# EAGLE design Macro Keyboard 32u4 Row Column MiniMacro v1.0 (EAGLE 9.6.2)
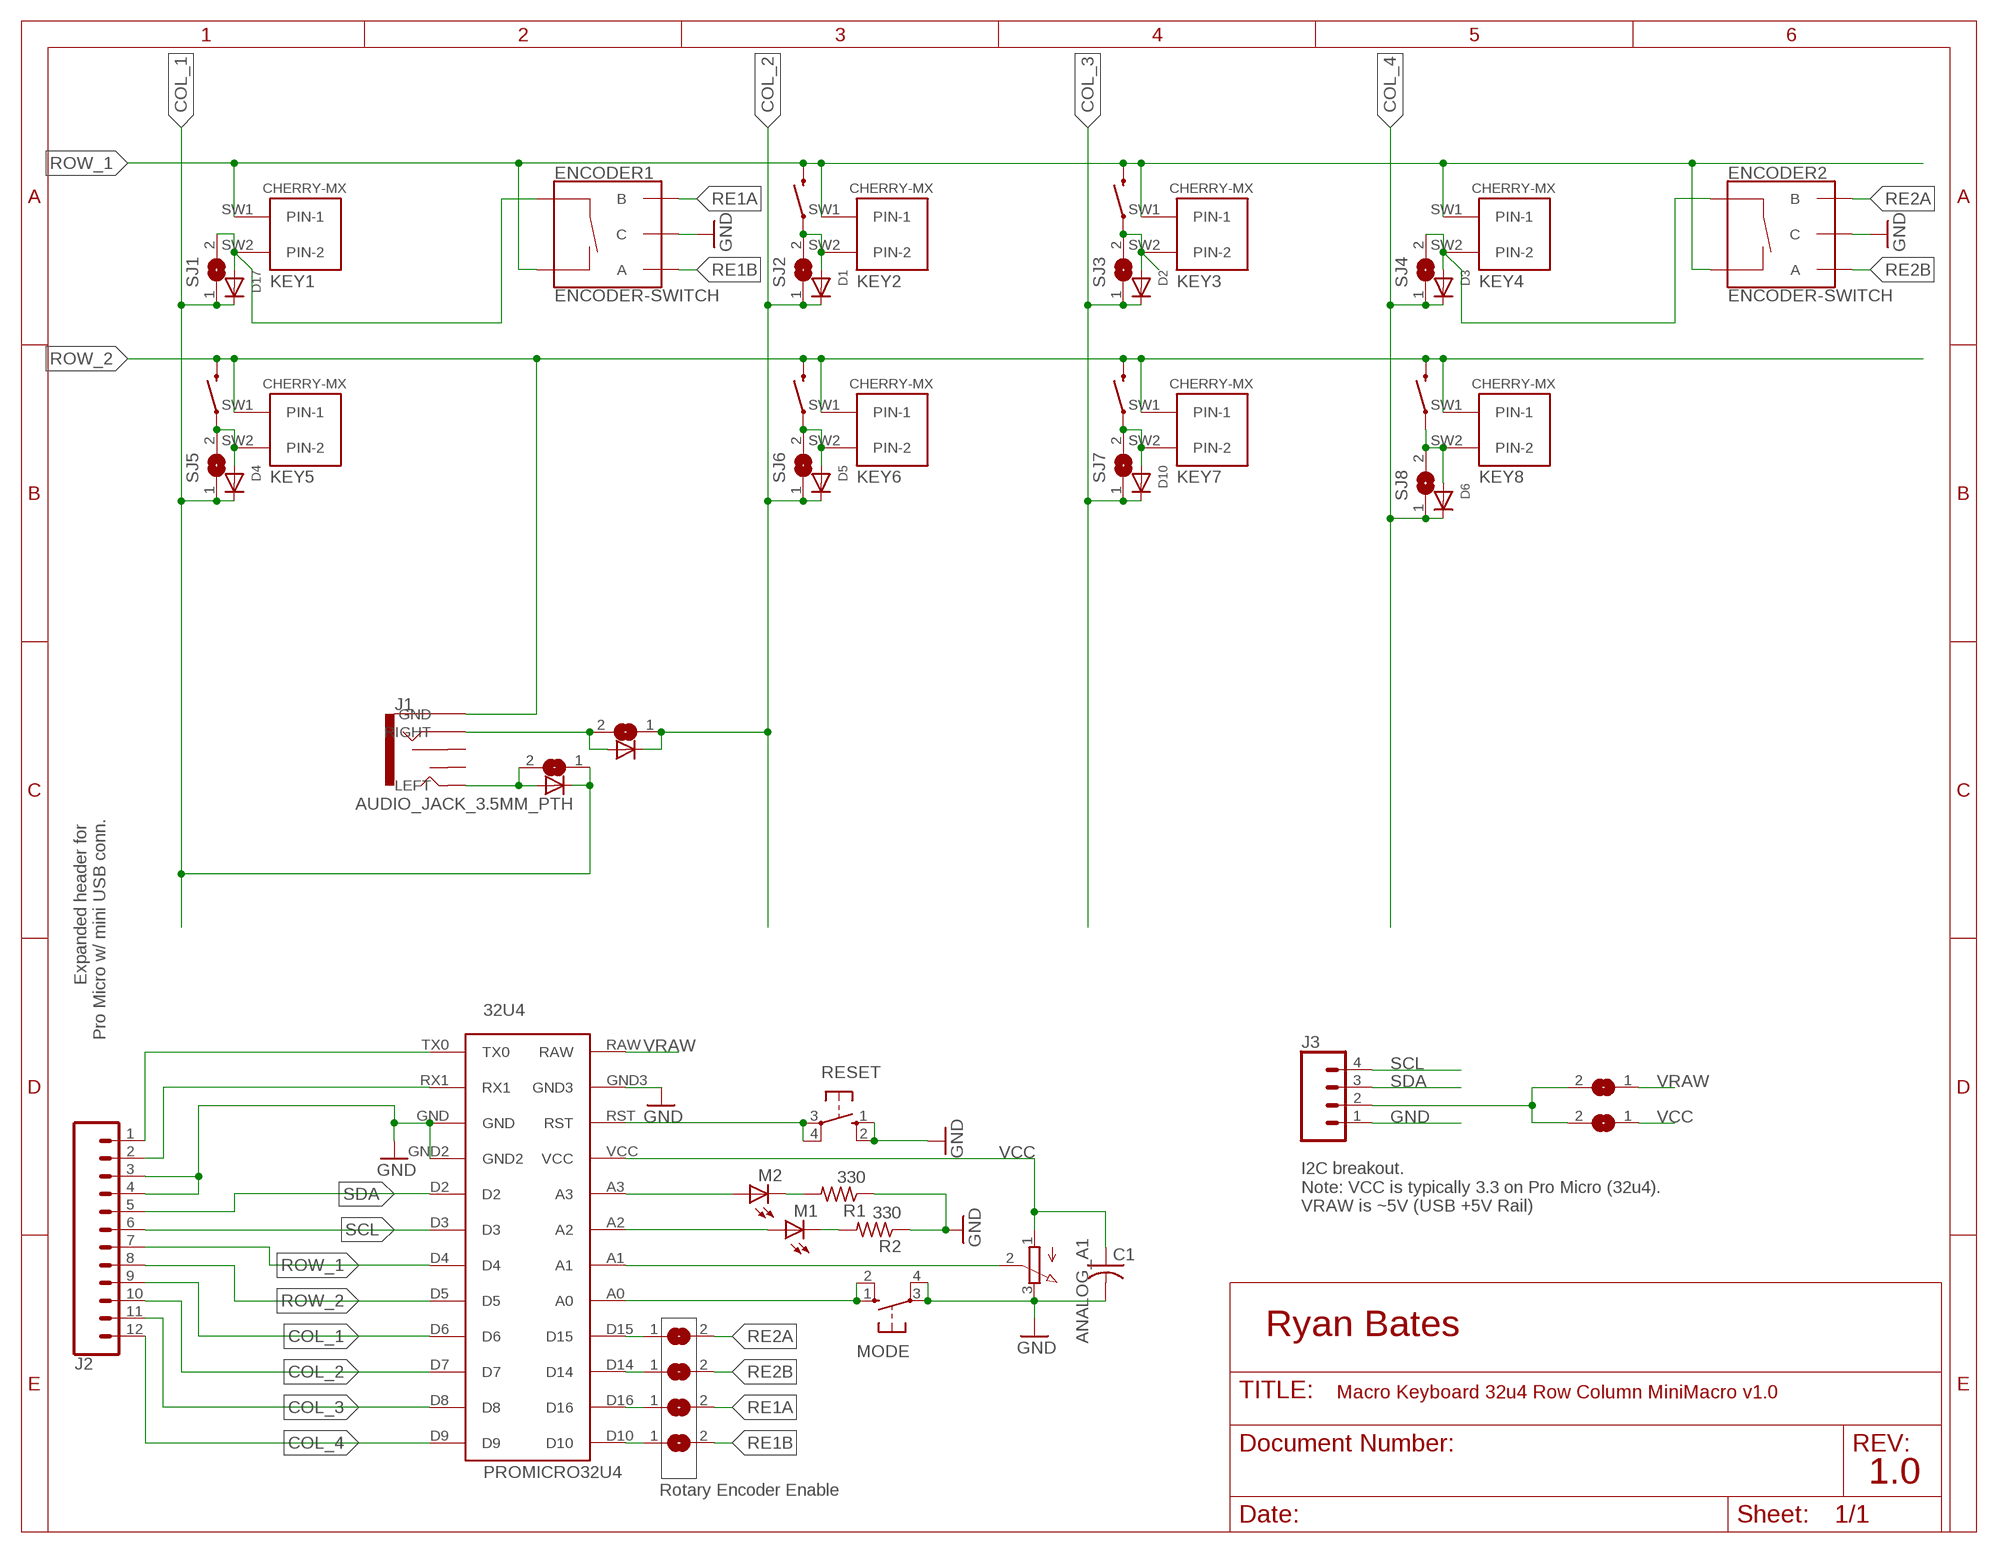
[diagram p0: schematic, sheet 1]

## Parts
32U4  PROMICRO32U4  [PROMICRO32U4]
ANALOG_A1  3RP/1610N  [3RP/1610N]
C1  C-USC1206  [C1206]
D1  DIODESOD-123  [SOD-123]
D2  DIODESOD-123  [SOD-123]
D3  DIODESOD-123  [SOD-123]
D4  DIODESOD-123  [SOD-123]
D5  DIODESOD-123  [SOD-123]
D6  DIODESOD-123  [SOD-123]
D10  DIODESOD-123  [SOD-123]
D15  DIODESOD-123  [SOD-123]
D16  DIODESOD-123  [SOD-123]
D17  DIODESOD-123  [SOD-123]
ENCODER1  ENCODER-SWITCH  [ROTARY_ENC_PLAIN]
ENCODER2  ENCODER-SWITCH  [ROTARY_ENC_PLAIN]
J1  AUDIO_JACK_3.5MM_PTH  [AUDIO-JACK]
J2  CONN_12NO_SILK  [1X12_NO_SILK]
J3  CONN_041X04_NO_SILK  [1X04_NO_SILK]
KEY1  CHERRY-MX  [CHERRY-MX]
KEY2  CHERRY-MX  [CHERRY-MX]
KEY3  CHERRY-MX  [CHERRY-MX]
KEY4  CHERRY-MX  [CHERRY-MX]
KEY5  CHERRY-MX  [CHERRY-MX]
KEY6  CHERRY-MX  [CHERRY-MX]
KEY7  CHERRY-MX  [CHERRY-MX]
KEY8  CHERRY-MX  [CHERRY-MX]
M1  LEDCHIPLED_1206  [CHIPLED_1206]
M2  LEDCHIPLED_1206  [CHIPLED_1206]
MODE  10-XX  [B3F-10XX]
R1  330  R-US_R1206  [R1206]
R2  330  R-US_R1206  [R1206]
RESET  10-XX  [B3F-10XX]
S1  MOMENTARY-SWITCH-SPST-PTH-12MM  [TACTILE_SWITCH_PTH_12MM]
S2  MOMENTARY-SWITCH-SPST-PTH-12MM  [TACTILE_SWITCH_PTH_12MM]
S3  MOMENTARY-SWITCH-SPST-PTH-12MM  [TACTILE_SWITCH_PTH_12MM]
S4  MOMENTARY-SWITCH-SPST-PTH-12MM  [TACTILE_SWITCH_PTH_12MM]
S9  MOMENTARY-SWITCH-SPST-PTH-12MM  [TACTILE_SWITCH_PTH_12MM]
S10  MOMENTARY-SWITCH-SPST-PTH-12MM  [TACTILE_SWITCH_PTH_12MM]
SJ1  SJ  [SJ]
SJ2  SJ  [SJ]
SJ3  SJ  [SJ]
SJ4  SJ  [SJ]
SJ5  SJ  [SJ]
SJ6  SJ  [SJ]
SJ7  SJ  [SJ]
SJ8  SJ  [SJ]
SJ9  SJ  [SJ]
SJ10  SJ  [SJ]
SJ16  SJ  [SJ]
SJ17  SJ  [SJ]
SJ18  SJ  [SJ]
SJ19  SJ  [SJ]
SJ20  SJ  [SJ]
SJ21  SJ  [SJ]

## Nets
COL_1: 32U4.D6 D4.C D15.C D17.C J2.9 SJ1.1 SJ5.1 SJ16.1
COL_2: 32U4.D7 D1.C D5.C D16.C J2.10 SJ2.1 SJ6.1 SJ17.1
COL_3: 32U4.D8 D2.C D10.C J2.11 SJ3.1 SJ7.1
COL_4: 32U4.D9 D3.C D6.C J2.12 SJ4.1 SJ8.1
GND: 32U4.GND 32U4.GND2 32U4.GND3 ANALOG_A1.3(E) C1.2 ENCODER1.C ENCODER2.C J2.3 J2.4 J3.1 MODE.3(P) MODE.4(P1) R1.1 R2.1 RESET.1(S) RESET.2(S1)
N$1: 32U4.RX1 J2.2
N$2: D1.A KEY2.SW2(PIN-2) S4.1 SJ2.2
N$3: D4.A KEY5.SW2(PIN-2) S9.1 SJ5.2
N$4: D5.A KEY6.SW2(PIN-2) S10.1 SJ6.2
N$5: J3.2 SJ9.2 SJ10.2
N$7: D3.A ENCODER2.SW+ KEY4.SW2(PIN-2) SJ4.2
N$8: D2.A KEY3.SW2(PIN-2) S3.1 SJ3.2
N$9: D16.A J1.RIGHT SJ17.2
N$10: 32U4.RST RESET.3(P) RESET.4(P1)
N$11: 32U4.TX0 J2.1
N$12: 32U4.A0 MODE.1(S) MODE.2(S1)
N$13: 32U4.A3 M2.A
N$14: M2.C R1.2
N$15: D10.A KEY7.SW2(PIN-2) S1.1 SJ7.2
N$19: D6.A KEY8.SW2(PIN-2) S2.1 SJ8.2
N$20: D17.A ENCODER1.SW+ KEY1.SW2(PIN-2) SJ1.2
N$21: M1.C R2.2
N$22: 32U4.A2 M1.A
N$25: 32U4.A1 ANALOG_A1.2(S)
N$35: 32U4.D15 SJ18.1
N$36: 32U4.D14 SJ19.1
N$37: 32U4.D16 SJ20.1
N$38: 32U4.D10 SJ21.1
N$41: D15.A J1.LEFT SJ16.2
RE1A: ENCODER1.B SJ20.2
RE1B: ENCODER1.A SJ21.2
RE2A: ENCODER2.B SJ18.2
RE2B: ENCODER2.A SJ19.2
ROW_1: 32U4.D4 ENCODER1.SW- ENCODER2.SW- J2.7 KEY1.SW1(PIN-1) KEY2.SW1(PIN-1) KEY3.SW1(PIN-1) KEY4.SW1(PIN-1) S3.3 S4.3
ROW_2: 32U4.D5 J1.GND J2.8 KEY5.SW1(PIN-1) KEY6.SW1(PIN-1) KEY7.SW1(PIN-1) KEY8.SW1(PIN-1) S1.3 S2.3 S9.3 S10.3
SCL: 32U4.D3 J2.6 J3.4
SDA: 32U4.D2 J2.5 J3.3
VCC: 32U4.VCC ANALOG_A1.1(A) C1.1 SJ10.1
VRAW: 32U4.RAW SJ9.1
Unconnected: J1.RSH J1.TSH

## Notes on the sheet
- Expanded header for 
  Pro Micro w/ mini USB conn.
- I2C breakout. 
  Note: VCC is typically 3.3 on Pro Micro (32u4).
  VRAW is ~5V (USB +5V Rail)
- Ryan Bates
- 1.0
- Rotary Encoder Enable

## Library data of the parts
32U4 = Pro-micro32u4:PROMICRO32U4
ANALOG_A1 = pot:3RP/1610N: 16mm Potentiometer one level Source: http://www.alphapotentiometers.net/html/16mm_pot_2.html
C1 = adafruit:C-US: CAPACITOR, American symbol
D1-D6 D10 D15-D17 = adafruit:DIODE: Diode SMADIODE - SMA Surface Mount Package 20V 1A Schottky Diode Digikey: 641-1014-6-ND DO-1N4148 - Through Hole Small Current Diode SOD-123 20V 1 A (.5mV Vf) Schottky Diode - Digikey: MBRX120TPMSCT-ND SOD-323 10V 570mA (.38mV Vf, 3ns) Schottky Diode - Digikey: ZLLS410CT-ND SOD-523 30V 30mA Schottky Diode (RB751S-40TE61) - Digikey: RB751S-40TE61CT-ND SOT23-R/W - SOT23 Package (R = Solder Paste/Reflow Ovens, W = Hand-Soldering) BAT54Film 40V 300mA - Digikey: 497-7162-1-ND
ENCODER1 ENCODER2 = SparkFun-Switches:ENCODER-SWITCH: Rotary Encoder w/ Select Switch Encoders rotate similarly to potentiometers, but they’re different from potentiometers in that an encoder has full rotation without limits. They output gray code so that you can tell how much and in which direction the encoder has been turned. This encoder includes a push-down select switch built into the shaft. SparkFun Products Rotary Encoder <https://www.sparkfun.com/products/9117> (COM-09117); SF_SKU: COM-09117
J1 = SparkFun-Connectors:AUDIO_JACK_3.5MM: Audio Jack 3.5mm variants of PTH and SMT stereo audio jack with bypass switches. SparkFun Products: SparkFun SparkPunk Sound Kit <[https://www.sparkfun.com/products/11177]> - PTH MP3 Trigger <https://www.sparkfun.com/products/13720> -3.5mm SMD SparkFun PicoBoard <https://www.sparkfun.com/products/11888>- 2.5mm SMD; PROD_ID: CONN-08774; SF_ID: PRT-08032
J2 = SparkFun-Connectors:CONN_12: Multi connection point. Often used as Generic Header-pin footprint for 0.1 inch spaced/style header connections On any of the 0.1 inch spaced packages, you can populate with these: Break Away Headers - Straight <https://www.sparkfun.com/products/116> (PRT-00116) Break Away Male Headers - Right Angle <https://www.sparkfun.com/products/553> (PRT-00553) Female Headers <https://www.sparkfun.com/products/115> (PRT-00115) Break Away Headers - Machine Pin <https://www.sparkfun.com/products/117> (PRT-00117) Break Away Female Headers - Swiss Machine Pin <https://www.sparkfun.com/products/743> (PRT-00743) For SCREWTERMINALS and SPRING TERMINALS visit here: Screw Terimnals on SparkFun.com <https://www.sparkfun.com/search/results?term=Screw+Terminals> (5mm/3.5mm/2.54mm spacing) This device is also useful as a general connection point to wire up your design to another part of your project. Our various solder wires solder well into these plated through hole pads. Hook-Up Wire - Assortment (Stranded, 22 AWG) <https://www.sparkfun.com/products/11375> (PRT-11375) Hook-Up Wire - Assortment (Solid Core, 22 AWG) <https://www.sparkfun.com/products/11367> (PRT-11367) View the entire wire category on our website here <https://www.sparkfun.com/categories/141> Special notes: Molex polarized connector foot print use with SKU : PRT-08231 with associated crimp pins and housings. 1MM SMD Version SKU: PRT-10208 NOTES ON THE VARIANTS LOCK and LOCK_LONGPADS... This footprint was designed to help hold the alignment of a through-hole component (i.e. 6-pin header) while soldering it into place. You may notice that each hole has been shifted either up or down by 0.005 of an inch from it's more standard position (which is a perfectly straight line). This slight alteration caused the pins (the squares in the middle) to touch the edges of the holes. Because they are alternating, it causes a "brace" to hold the component in place. 0.005 has proven to be the perfect amount of "off-center" position when using our standard breakaway headers. Although looks a little odd when you look at the bare footprint, once you have a header in there, the alteration is very hard to notice. Also,if you push a header all the way into place, it is covered up entirely on the bottom side.
J3 = SparkFun-Connectors:CONN_04: Multi connection point. Often used as Generic Header-pin footprint for 0.1 inch spaced/style header connections On any of the 0.1 inch spaced packages, you can populate with these: Break Away Headers - Straight <https://www.sparkfun.com/products/116> (PRT-00116) Break Away Male Headers - Right Angle <https://www.sparkfun.com/products/553> (PRT-00553) Female Headers <https://www.sparkfun.com/products/115> (PRT-00115) Break Away Headers - Machine Pin <https://www.sparkfun.com/products/117> (PRT-00117) Break Away Female Headers - Swiss Machine Pin <https://www.sparkfun.com/products/743> (PRT-00743) For SCREWTERMINALS and SPRING TERMINALS visit here: Screw Terimnals on SparkFun.com <https://www.sparkfun.com/search/results?term=Screw+Terminals> (5mm/3.5mm/2.54mm spacing) This device is also useful as a general connection point to wire up your design to another part of your project. Our various solder wires solder well into these plated through hole pads. Hook-Up Wire - Assortment (Stranded, 22 AWG) <https://www.sparkfun.com/products/11375> (PRT-11375) Hook-Up Wire - Assortment (Solid Core, 22 AWG) <https://www.sparkfun.com/products/11367> (PRT-11367) View the entire wire category on our website here <https://www.sparkfun.com/categories/141> Special notes: Molex polarized connector foot print use with SKU : PRT-08231 with associated crimp pins and housings. 1MM SMD Version SKU: PRT-10208; PROD_ID: CONN-09696
KEY1-KEY8 = cherrymx:CHERRY-MX: Cherry MX series keyswitch
M1 M2 = adafruit:LED: LED OSRAM: - CHIPLED LG R971, LG N971, LY N971, LG Q971, LY Q971, LO R971, LY R971 LH N974, LH R974 LS Q976, LO Q976, LY Q976 LO Q996 - Hyper CHIPLED LW Q18S LB Q993, LB Q99A, LB R99A - SideLED LS A670, LO A670, LY A670, LG A670, LP A670 LB A673, LV A673, LT A673, LW A673 LH A674 LY A675 LS A676, LA A676, LO A676, LY A676, LW A676 LS A679, LY A679, LG A679 - Hyper Micro SIDELED® LS Y876, LA Y876, LO Y876, LY Y876 LT Y87S - SmartLED LW L88C, LW L88S LB L89C, LB L89S, LG L890 LS L89K, LO L89K, LY L89K LS L896, LA L896, LO L896, LY L896 - TOPLED LS T670, LO T670, LY T670, LG T670, LP T670 LSG T670, LSP T670, LSY T670, LOP T670, LYG T670 LG T671, LOG T671, LSG T671 LB T673, LV T673, LT T673, LW T673 LH T674 LS T676, LA T676, LO T676, LY T676, LB T676, LH T676, LSB T676, LW T676 LB T67C, LV T67C, LT T67C, LS T67K, LO T67K, LY T67K, LW E67C LS E67B, LA E67B, LO E67B, LY E67B, LB E67C, LV E67C, LT E67C LW T67C LS T679, LY T679, LG T679 LS T770, LO T770, LY T770, LG T770, LP T770 LB T773, LV T773, LT T773, LW T773 LH T774 LS E675, LA E675, LY E675, LS T675 LS T776, LA T776, LO T776, LY T776, LB T776 LHGB T686 LT T68C, LB T68C - Hyper Mini TOPLED® LB M676 - Mini TOPLED Santana® LG M470 LS M47K, LO M47K, LY M47K Source: http://www.osram.convergy.de/
MODE RESET = switch-omron:10-XX: OMRON SWITCH; MPN: B3F-1000; OC_FARNELL: 176432; OC_NEWARK: 36M3542
R1 R2 = adafruit:R-US_: RESISTOR, American symbol
S1-S4 S9 S10 = SparkFun-Switches:MOMENTARY-SWITCH-SPST: Momentary Switch (Pushbutton) - SPST Normally-open (NO) SPST momentary switches (buttons, pushbuttons). Variants PTH-12MM - 12mm square, through-hole Momentary Pushbutton Switch - 12mm Square <https://www.sparkfun.com/products/9190> (COM-09190) PTH-6.0MM, PTH-6.0MM-KIT - 6.0mm square, through-hole Mini Pushbutton Switch <https://www.sparkfun.com/products/97> (COM-00097) KIT package intended for soldering kit's - only one side of pads' copper is exposed. PTH-RIGHT-ANGLE-KIT - Right-angle, through-hole Right Angle Tactile Button <https://www.sparkfun.com/products/10791> - Used on SparkFun BigTime Watch Kit <https://www.sparkfun.com/products/11734> SMD-12MM - 12mm square, surface-mount Tactile Button - SMD (12mm) <https://www.sparkfun.com/products/12993> (COM-12993) Used on SparkFun PicoBoard <https://www.sparkfun.com/products/11888> SMD-4.5MM - 4.5mm Square Trackball Switch Used on SparkFun Blackberry Trackballer Breakout <https://www.sparkfun.com/products/13169> SMD-4.6MMX2.8MM - 4.60mm x 2.80mm, surface mount Used on SparkFun SAMD21 Mini Breakout <https://www.sparkfun.com/products/13664> SMD-5.2MM, SMD-5.2-REDUNDANT - 5.2mm square, surface-mount Mini Pushbutton Switch - SMD <https://www.sparkfun.com/products/8720> (COM-08720) Used on Arduino Pro Mini <https://www.sparkfun.com/products/11114> REDUNDANT package connects both switch circuits together SMD-6.0X3.5MM - 6.0 x 3.5mm, surface mount Momentary Reset Switch SMD <https://www.sparkfun.com/products/8229> (COM-08229) SMD-6.2MM-TALL - 6.2mm square, surface mount Tactile Button - SMD (6mm) <https://www.sparkfun.com/products/12992> Used on SparkFun Digital Sandbox <https://www.sparkfun.com/products/12651> SMD-RIGHT-ANGLE - Right-angle, surface mount Used on SparkFun Block for Intel® Edison - Arduino <https://www.sparkfun.com/products/13036>; PROD_ID: SWCH-09185; SF_SKU: COM-09190
SJ1-SJ10 SJ16-SJ21 = jumper:SJ: SMD solder JUMPER

## Net classes
0 vcc: width 0.254 mm, clearance 0.127 mm

## Board
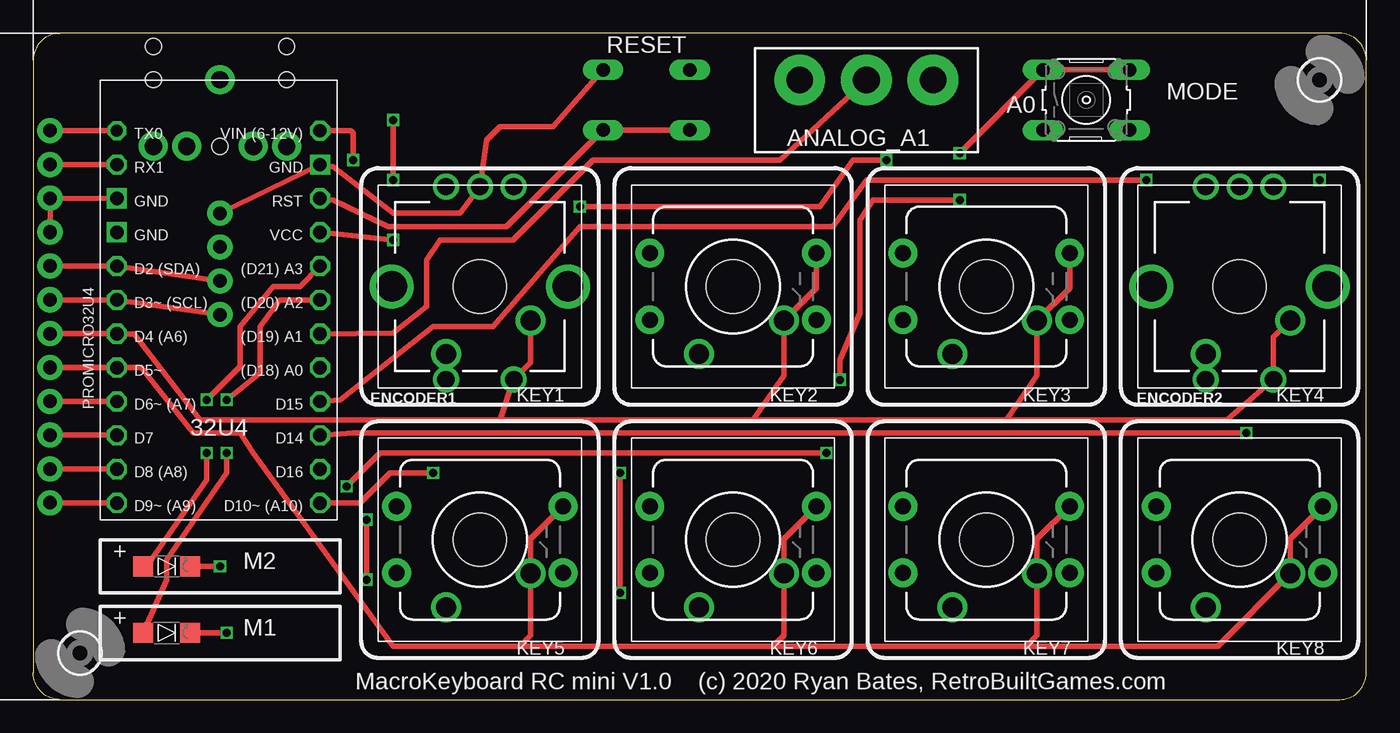
[diagram p1: board, top side]
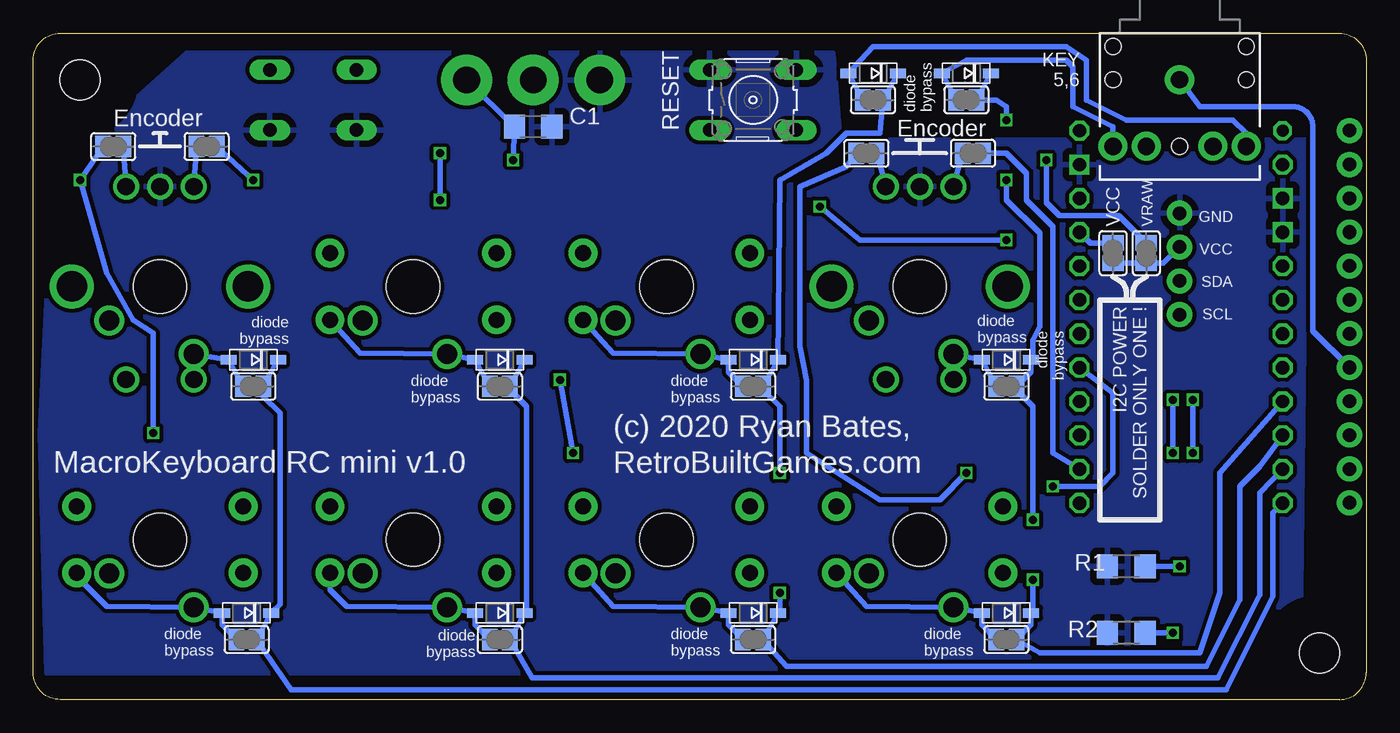
[diagram p2: board, bottom side, seen from below]

Size 100 x 50 mm. Coordinates in mm from the lower left corner, seen from the top.
Outline: 2,0 98,0 arc90 100,2 100,48 arc90 98,50 2,50 arc90 0,48 0,2 arc90 2,0
Copper layers (1*16): Top 0.035mm / dielectric 1.5mm / Bottom 0.035mm
Design rules "SeeedStudio_2layer_DRU_no_angle_20140221 *": minimum track width 8mil, minimum drill 12mil, track to track 8mil, track to pad 8mil, pad to pad 8mil, via to via 8mil, smd to smd 0mil, copper to edge 10mil, drill to drill 10mil, minimum pad ring 10mil, minimum via ring 6mil, stop-mask expansion 2mil, vias tented up to drill 100mil, thermal gap 20mil

### Footprints (pad centres in the part's own frame; a part is rotated, then mirrored left to right if it is on the bottom)
PROMICRO32U4 = drill 1 octagon: A0 16.51,-21.59; A1 16.51,-19.05; A2 16.51,-16.51; A3 16.51,-13.97; D2 1.27,-13.97; D3 1.27,-16.51; D4 1.27,-19.05; D5 1.27,-21.59; D6 1.27,-24.13; D7 1.27,-26.67; D8 1.27,-29.21; D9 1.27,-31.75; D10 16.51,-31.75; D14 16.51,-26.67; D15 16.51,-24.13; D16 16.51,-29.21; RAW 16.51,-3.81; RST 16.51,-8.89; RX1 1.27,-6.35; VCC 16.51,-11.43 | drill 1 square: GND 1.27,-8.89; GND2 1.27,-11.43; GND3 16.51,-6.35 | drill 0.9 octagon: TX0 1.27,-3.81
3RP/1610N = drill 2 pad 3.81: 1 -5,0; 2 0,0; 3 5,0
C1206 = smd 1.6 x 1.8: 1 -1.4,0; 2 1.4,0
SOD-123 = smd 1.2 x 0.7: A 1.85,0; C -1.85,0
ROTARY_ENC_PLAIN = drill 1.3: A 7.493,-2.54; B 7.493,2.54; C 7.493,0; SW+ -6.985,2.54; SW- -6.985,-2.54 | drill 2.286: P$3 0,6.604; P$4 0,-6.604
AUDIO-JACK = drill 1.3 pad 2.184: GND 0,0; LEFT 5,-5; RIGHT 5,5; RSH 5,2.5; TSH 5,-2.5 | hole 1.2: 0,5; -2.5,5; -2.5,-5; 0,-5; 5,0
1X12_NO_SILK = drill 1.016 pad 1.88: 1 0,0; 2 2.54,0; 3 5.08,0; 4 7.62,0; 5 10.16,0; 6 12.7,0; 7 15.24,0; 8 17.78,0; 9 20.32,0; 10 22.86,0; 11 25.4,0; 12 27.94,0
1X04_NO_SILK = drill 1.016 pad 1.88: 1 0,0; 2 2.54,0; 3 5.08,0; 4 7.62,0
CHERRY-MX = drill 1.5 pad 2.184: SW1 -3.81,2.54; SW2 2.54,5.08 | hole 4: 0,0
CHIPLED_1206 = smd 1.5 x 1.5: A 0,-1.75; C 0,1.75
B3F-10XX = drill 1.016 long: 1 -3.251,2.261; 2 3.251,2.261; 3 -3.251,-2.261; 4 3.251,-2.261
R1206 = smd 1.6 x 1.803: 1 -1.422,0; 2 1.422,0
TACTILE_SWITCH_PTH_12MM = drill 1.2 pad 2.159: 1 6.25,-2.5; 2 -6.25,-2.5; 3 6.25,2.5; 4 -6.25,2.5
SJ = smd 1.168 x 1.6: 1 -0.762,0; 2 0.762,0
3,0 = hole 3: 0,0

### Placement (x,y rotation side)
32U4  5,46.5 0 top
ANALOG_A1  62.5,46.5 180 top
C1  62.5,43 0 bottom
D1  46,25.5 180 bottom
D2  65,25.5 180 bottom
D3  83.5,25.5 180 bottom
D4  27,6.5 180 bottom
D5  46,6.5 180 bottom
D6  84,6.5 180 bottom
D10  65,6.5 180 bottom
D15  30,47 180 bottom
D16  37,47 180 bottom
D17  27,25.5 180 bottom
ENCODER1  33.5,31 90 top
ENCODER2  90.5,31 90 top
J1  14,46.52 270 bottom
J2  1.25,42.7 270 top
J3  14,36.5 270 top
KEY1  33.5,31 180 top
KEY2  52.5,31 180 top
KEY3  71.5,31 180 top
KEY4  90.5,31 180 top
KEY5  33.5,12 180 top
KEY6  52.5,12 180 top
KEY7  71.5,12 180 top
KEY8  90.5,12 180 top
M1  10,5 270 top
M2  10,10 270 top
MODE  79,45 0 top
R1  18,10 0 bottom
R2  18,5 0 bottom
RESET  46,45 0 bottom
S1  71.5,12 0 top
S2  90.5,12 0 top
S3  71.5,31 0 top
S4  52.5,31 0 top
S9  33.5,12 0 top
S10  52.5,12 0 top
SJ1  27,23.5 180 bottom
SJ2  46,23.5 180 bottom
SJ3  65,23.5 180 bottom
SJ4  83.5,23.5 180 bottom
SJ5  27,4.5 180 bottom
SJ6  46,4.5 180 bottom
SJ7  65,4.5 180 bottom
SJ8  84,4.5 180 bottom
SJ9  16.5,33.5 270 bottom
SJ10  19,33.5 270 bottom
SJ16  30,45 180 bottom
SJ17  37,45 180 bottom
SJ18  87,41.5 180 bottom
SJ19  94,41.5 0 bottom
SJ20  29.5,41 180 bottom
SJ21  37.5,41 0 bottom
U$7  [3,0]  3.5,3.5 0 top
U$8  [3,0]  96.5,46.5 0 top

### Tracks (layer width: path | path; a pad name or v marks a point on that pad's centre or on a via)
COL_1  (via drill 0.6)
  Top 0.305: 32U4.D6
  Top 0.406: J2.9 32U4.D6 | v27,43.5 v27,39 | v25,13.5 v25,9
  Bottom 0.406: D15.C SJ16.1 27.75,45 27,44.5 v27,43.5 | 32U4.D6 11,17 11,8 12.5,3.5 24.5,3.5 SJ5.1 25.15,5.59 D4.C 25,6.65 v25,9 | v27,39 27,37.5 24.5,35 24.5,28 25,27 25,25.5 D17.C 25.15,24.59 SJ1.1 26.24,23.24 25,22 v25,13.5
COL_2  (via drill 0.6)
  Top 0.305: 32U4.D7
  Top 0.406: J2.10 32U4.D7 | v44,17 v44,8
  Bottom 0.406: D16.C SJ17.1 36.5,42.5 39,42.5 40.5,41 44,39 D1.C SJ2.1 45.24,23.24 44,22 v44,17 | 32U4.D7 8,17.5 9.5,16 9.5,7.5 12,2.5 43.5,2.5 SJ6.1 D5.C 44,6.65 v44,8
COL_3
  Top 0.305: 32U4.D8
  Top 0.406: J2.11 32U4.D8
  Bottom 0.406: D2.C SJ3.1 64.24,23.24 63,22 63,6.65 D10.C SJ7.1 62.57,1.62 11.12,1.62 8,7.88 8,15.5 32U4.D8
COL_4
  Top 0.305: J2.12
  Top 0.406: 32U4.D9 J2.12
  Bottom 0.406: D3.C SJ4.1 82.74,22.74 81.5,21.5 81.5,7.15 D6.C SJ8.1 80.67,0.75 10.5,0.75 7,7.75 7,14 6.5,14.5 6.5,14.52 32U4.D9
GND
  Top 0.406: J2.4 J2.3 32U4.GND | RESET.2 39,43 35,43 34,42 ENCODER1.C 32,36.5 27,36.5 22.5,40 32U4.GND3 J3.1
  pour Bottom (isolate 0.305): 40,48.5 88.5,48.5 98.5,39.5 99.5,20 99,2 5,2 4.5,42 39.5,42
N$1
  Top 0.305: 32U4.RX1
  Top 0.406: J2.2 32U4.RX1
N$2
  Bottom 0.406: SJ2.2 47.85,24.59 D1.A KEY2.SW2 56.5,26 S4.1
N$3
  Bottom 0.406: SJ5.2 28.85,5.59 D4.A KEY5.SW2 37.5,7 S9.1
N$4
  Bottom 0.406: SJ6.2 47.85,5.59 D5.A KEY6.SW2 56.5,7 S10.1
N$5
  Bottom 0.406: SJ10.2 SJ9.2 15.22,32.74 J3.2
N$7
  Bottom 0.406: SJ4.2 D3.A KEY4.SW2 ENCODER2.SW+
N$8
  Bottom 0.406: SJ3.2 D2.A KEY3.SW2 75.5,26 S3.1
N$9
  Bottom 0.406: SJ17.2 D16.A 37,49 22.5,49 21,48 21,45 18,43.5 10,43.5 9,42.5 J1.RIGHT
N$10
  Top 0.406: RESET.3 RESET.4 35.5,35.5 26.62,35.5 22.5,37.5 32U4.RST
N$11
  Top 0.305: 32U4.TX0
  Top 0.406: J2.1 32U4.TX0
N$12  (via drill 0.6)
  Top 0.406: v23.5,16 26,18.5 v59.5,18.5 | v60.5,24 60.5,25.5 62,29 62,36 63,37.5 v69.5,37.5 | v69.5,41 MODE.1 MODE.2
  Bottom 0.406: 32U4.A0 19,23 19,17 20,16 v23.5,16 | v59.5,18.5 v60.5,24 | v69.5,37.5 v69.5,41
N$13  (via drill 0.6)
  Top 0.406: 32U4.A3 20,31 18,31 15.5,28 15.5,25 v13,22.5 | M2.A 8.5,10 13,16.5 v13,18.5
  Bottom 0.406: v13,18.5 v13,22.5
N$14  (via drill 0.6)
  Top 0.406: M2.C v14,10
  Bottom 0.406: v14,10 R1.2
N$15
  Bottom 0.406: S1.1 77.75,8.25 76.5,7 KEY7.SW2 D10.A 66.85,5.59 SJ7.2
N$19
  Bottom 0.406: SJ8.2 85.85,5.59 D6.A KEY8.SW2 94.5,7 96.75,9.25 S2.1
N$20
  Bottom 0.406: SJ1.2 D17.A KEY1.SW2 ENCODER1.SW+
N$21  (via drill 0.6)
  Top 0.406: M1.C v14.5,5
  Bottom 0.406: v14.5,5 R2.2
N$22  (via drill 0.6)
  Top 0.406: 32U4.A2 18.49,29.99 17,28 17,24.5 v14.5,22.5 | v14.5,18.5 14.5,17 10,10.5 10,9 M1.A
  Bottom 0.406: v14.5,18.5 v14.5,22.5
N$25
  Top 0.406: 32U4.A1 27,27.5 29.5,29.5 29.5,33 30.5,34.5 36,34.5 42,40.5 56,40.5 ANALOG_A1.2
N$35  (via drill 0.6)
  Top 0.406: 32U4.D15 23,22.5 30,28 34.5,28 41,35.5 60,35.5 62.5,39 v83.5,39
  Bottom 0.406: v83.5,39 SJ18.1
N$36  (via drill 0.6)
  Top 0.406: v91,20 24,20 32U4.D14
  Bottom 0.406: SJ19.1 v96.5,39 94.5,32 92.5,28.5 91,27.5 v91,20
N$37
  Bottom 0.406: SJ20.1 27,41 25.5,39.5 25.5,37.5 23.5,35.5 23.5,18.5 32U4.D16
N$38  (via drill 0.6)
  Top 0.406: v30,17 26.76,17 24.51,14.75 32U4.D10
  Bottom 0.406: SJ21.1 39,40 42.5,38.5 42.5,26.5 42,24 42,18.5 36.5,15 32,15 v30,17
N$41
  Bottom 0.406: SJ16.2 D15.A 30,48 22.5,48 22,47.5 22,44.5 19,43 J1.LEFT
RE1A
  Bottom 0.406: SJ20.2 30.46,40.5 ENCODER1.B
RE1B
  Bottom 0.406: SJ21.2 36.54,40.5 ENCODER1.A
RE2A
  Bottom 0.406: ENCODER2.B SJ18.2
RE2B
  Bottom 0.406: ENCODER2.A SJ19.2
ROW_1
  Top 0.305: 32U4.D4
  Top 0.406: J2.7 32U4.D4 | 32U4.D4 7.55,27.45 12.5,21 35,21 | 35,21 54,21 | 54,21 73,21 | 73,21 89.53,21 ENCODER2.SW- 93.04,27.19 KEY4.SW1 | S3.3 77.75,30.9 KEY3.SW1 75.31,24.31 73,21 | 54,21 56.31,24.31 KEY2.SW1 58.75,30.9 S4.3 | 36.04,24.04 37.31,25.31 KEY1.SW1 | 36.04,24.04 35,21 | ENCODER1.SW- 36.04,24.04
ROW_2
  Top 0.305: 32U4.D5
  Top 0.406: J2.8 32U4.D5 8.08,24.92 12,20 15.5,20 16.5,18.5 27,4 36.5,4 | 36.5,4 55.5,4 | 55.5,4 74.5,4 | 74.5,4 88.85,4 KEY8.SW1 94.31,12.06 S2.3 | S9.3 37.31,12.06 KEY5.SW1 37.31,4.81 36.5,4 | S10.3 56.31,12.06 KEY6.SW1 56.31,4.81 55.5,4 | S1.3 75.31,12.06 KEY7.SW1 75.31,4.81 74.5,4
  Bottom 0.406: J1.GND 12.47,44.5 5.5,44.5 arc90 4,43 4,27.67 J2.8
SCL
  Top 0.305: 32U4.D3
  Top 0.406: J2.6 32U4.D3 | 32U4.D3 J3.4
SDA
  Top 0.305: 32U4.D2
  Top 0.406: J2.5 32U4.D2 | 32U4.D2 J3.3
VCC  (via drill 0.6)
  Top 0.406: 32U4.VCC v27,34.5 | v41,37 59,37 61.5,40.5 v64,40.5
  Bottom 0.406: ANALOG_A1.1 C1.1 v64,40.5 | v27,34.5 38,34.5 v41,37 | 32U4.VCC 20.7,34.26 SJ10.1
VRAW  (via drill 0.6)
  Top 0.406: 32U4.RAW 23.81,42.69 24,42.5 v24,40.5
  Bottom 0.406: SJ9.1 18.55,36.31 23.02,36.31 24,37.29 v24,40.5

### Text on the board
tPlace: RESET | A0 | + | + | MacroKeyboard RC mini V1.0 (c) 2020 Ryan Bates, RetroBuiltGames.com
bPlace: KEY / 5,6 | Encoder | diode / bypass | Encoder | VRAW | VCC | I2C POWER / SOLDER ONLY ONE ! | diode / bypass | GND / VCC / SDA / SCL | diode / bypass | diode / bypass | diode / bypass | diode / bypass | (c) 2020 Ryan Bates, / RetroBuiltGames.com | MacroKeyboard RC mini v1.0 | diode / bypass | diode / bypass | diode / bypass | diode / bypass